# EAGLE design MainBRD (EAGLE 6.1)

## Sheet 1 of 2
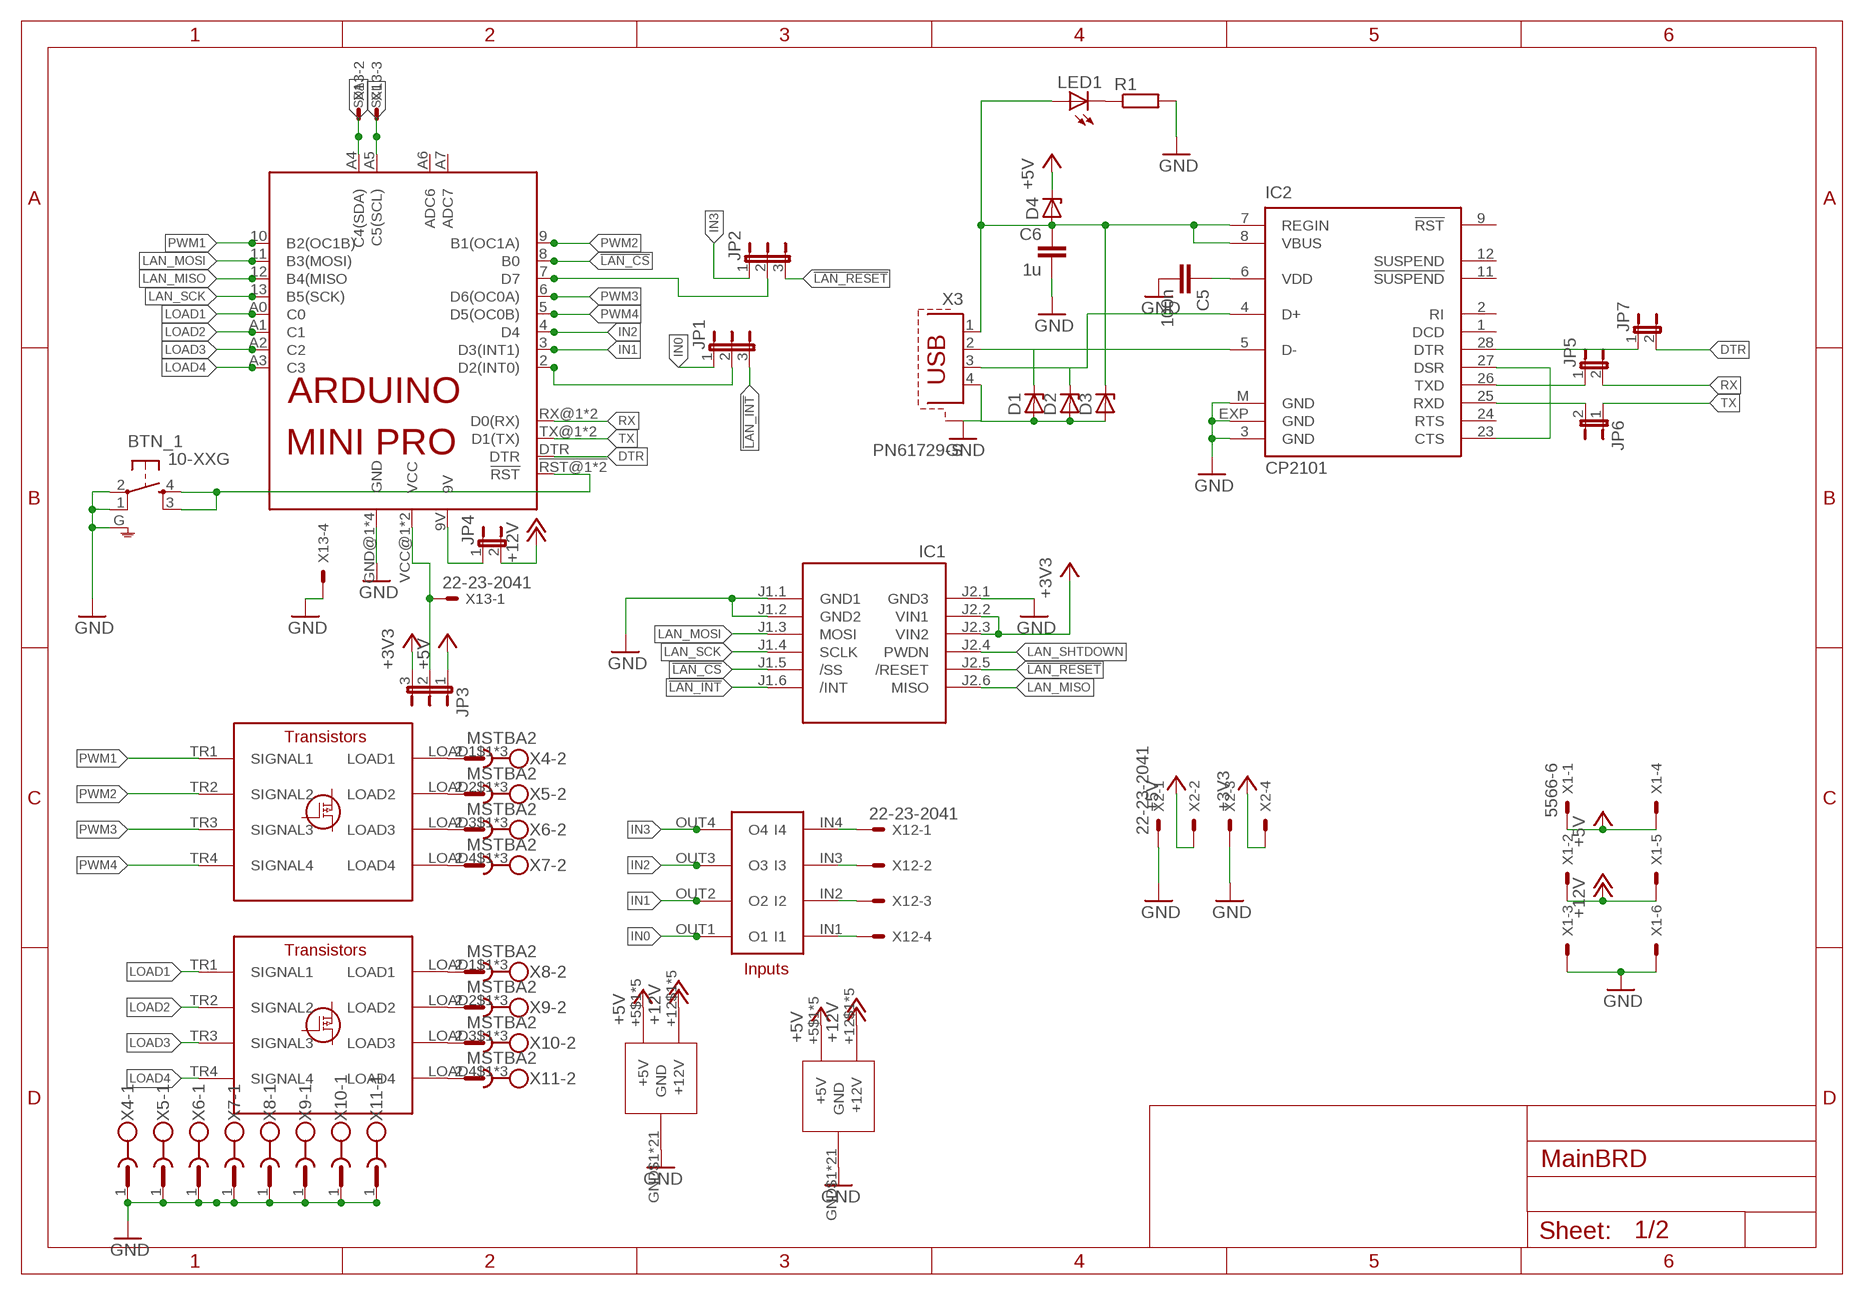
[diagram p0: schematic, sheet 1]

### Parts
BTN_1  10-XXG  [B3F-10XXG]
C5  100n  C-EUC0805  [C0805]
C6  1u  C-EUC1206  [C1206]
D1  ZENER-DIODESOD80C  [SOD80C]
D2  ZENER-DIODESOD80C  [SOD80C]
D3  ZENER-DIODESOD80C  [SOD80C]
D4  ZENER-DIODESOD80C  [SOD80C]
IC1  WIZ820IO_DEVICE'DUAL-IN-LINE'  [WIZ820IO]
IC2  CP2101  [MLP28]
JP1  JP2E  [JP2]
JP2  JP2E  [JP2]
JP3  JP2E  [JP2]
JP4  JP1E  [JP1]
JP5  JP1E  [JP1]
JP6  JP1E  [JP1]
JP7  JP1E  [JP1]
LED1  LEDCHIPLED_1206  [CHIPLED_1206]
R1  R-EU_M0805  [M0805]
U$1  ARDUINO_MINI_PRO  [ARDUINO_MINI_PRO]
U$2  KBLES_TRANSISTOR  [KBLES_TRANSISTOR]
U$3  KBLES_TRANSISTOR  [KBLES_TRANSISTOR]
X1  5566-6  [5566-6]
X2  22-23-2041  [22-23-2041]
X3  PN61729-S  [PN61729-S]
X4  MSTBA2  [MSTBA2]
X5  MSTBA2  [MSTBA2]
X6  MSTBA2  [MSTBA2]
X7  MSTBA2  [MSTBA2]
X8  MSTBA2  [MSTBA2]
X9  MSTBA2  [MSTBA2]
X10  MSTBA2  [MSTBA2]
X11  MSTBA2  [MSTBA2]
X12  22-23-2041  [22-23-2041]
X13  22-23-2041  [22-23-2041]

### Nets
!LAN_CS: IC1.J1.5(/SS) U$1.8(B0)
!LAN_INT: IC1.J1.6(/INT) JP1.3
!LAN_RESET: IC1.J2.5(/RESET) JP2.3
+3V3: IC1.J2.2(VIN1) IC1.J2.3(VIN2) JP3.3 X2.4
+5V: D4.C JP3.1 U$2.+5$1(+5V) U$2.+5$2(+5V) U$2.+5$3(+5V) U$2.+5$4(+5V) U$2.+5$5(+5V) U$3.+5$1(+5V) U$3.+5$2(+5V) U$3.+5$3(+5V) U$3.+5$4(+5V) U$3.+5$5(+5V) X1.1 X1.4 X2.2
+12V: JP4.2 U$2.+12$1(+12V) U$2.+12$2(+12V) U$2.+12$3(+12V) U$2.+12$4(+12V) U$2.+12$5(+12V) U$3.+12$1(+12V) U$3.+12$2(+12V) U$3.+12$3(+12V) U$3.+12$4(+12V) U$3.+12$5(+12V) X1.2 X1.5
DSR/CTS: IC2.23(CTS) IC2.27(DSR)
DTR: JP7.2 U$1.DTR
GND: BTN_1.1 BTN_1.2(P) BTN_1.G(GND) C5.2 C6.2 D1.A D2.A D3.A IC1.J1.1(GND1) IC1.J1.2(GND2) IC1.J2.1(GND3) IC2.3(GND) IC2.EXP(GND) IC2.M(GND) R1.2 U$1.GND@1(GND) U$1.GND@2(GND) U$1.GND@3(GND) U$1.GND@4(GND) U$2.GND$1(GND) U$2.GND$2(GND) U$2.GND$3(GND) U$2.GND$4(GND) U$2.GND$5(GND) U$2.GND$6(GND) U$2.GND$7(GND) U$2.GND$8(GND) U$2.GND$9(GND) U$2.GND$10(GND) U$2.GND$11(GND) U$2.GND$12(GND) U$2.GND$13(GND) U$2.GND$14(GND) U$2.GND$15(GND) U$2.GND$16(GND) U$2.GND$17(GND) U$2.GND$18(GND) U$2.GND$19(GND) U$2.GND$20(GND) U$2.GND$21(GND) U$3.GND$1(GND) U$3.GND$2(GND) U$3.GND$3(GND) U$3.GND$4(GND) U$3.GND$5(GND) U$3.GND$6(GND) U$3.GND$7(GND) U$3.GND$8(GND) U$3.GND$9(GND) U$3.GND$10(GND) U$3.GND$11(GND) U$3.GND$12(GND) U$3.GND$13(GND) U$3.GND$14(GND) U$3.GND$15(GND) U$3.GND$16(GND) U$3.GND$17(GND) U$3.GND$18(GND) U$3.GND$19(GND) U$3.GND$20(GND) U$3.GND$21(GND) X1.3 X1.6 X2.1 X2.3 X3.4 X3.SHLD@1(S1) X3.SHLD@2(S1) X4.1 X5.1 X6.1 X7.1 X8.1 X9.1 X10.1 X11.1 X13.4
IN0: JP1.1 U$2.OUT1(O1)
IN1: U$1.3(D3(INT1)) U$2.OUT2(O2)
IN2: U$1.4(D4) U$2.OUT3(O3)
IN3: JP2.1 U$2.OUT4(O4)
LAN_MISO: IC1.J2.6(MISO) U$1.12(B4(MISO)
LAN_MOSI: IC1.J1.3(MOSI) U$1.11(B3(MOSI))
LAN_SCK: IC1.J1.4(SCLK) U$1.13(B5(SCK))
LAN_SHTDOWN: IC1.J2.4(PWDN)
LOAD1: U$1.A0(C0) U$3.TR1(SIGNAL1)
LOAD2: U$1.A1(C1) U$3.TR2(SIGNAL2)
LOAD3: U$1.A2(C2) U$3.TR3(SIGNAL3)
LOAD4: U$1.A3(C3) U$3.TR4(SIGNAL4)
N$1: JP1.2 U$1.2(D2(INT0))
N$2: JP4.1 U$1.9V
N$3: JP3.2 U$1.VCC@1(VCC) U$1.VCC@2(VCC) X13.1
N$4: C6.1 D3.C D4.A IC2.7(REGIN) IC2.8(VBUS) LED1.A X3.1
N$5: JP2.2 U$1.7(D7)
N$6: IC2.25(RXD) JP6.2
N$7: D2.C IC2.4(D+) X3.3
N$8: IC2.26(TXD) JP5.1
N$9: D1.C IC2.5(D-) X3.2
N$10: IC2.28(DTR) JP7.1
N$11: U$2.LOAD1$1(LOAD1) U$2.LOAD1$2(LOAD1) U$2.LOAD1$3(LOAD1) X4.2
N$12: C5.1 IC2.6(VDD)
N$13: U$2.LOAD2$1(LOAD2) U$2.LOAD2$2.(LOAD2) U$2.LOAD2$3(LOAD2) X5.2
N$14: U$2.LOAD3$1(LOAD3) U$2.LOAD3$2(LOAD3) U$2.LOAD3$3(LOAD3) X6.2
N$15: U$2.LOAD4$1(LOAD4) U$2.LOAD4$2(LOAD4) U$2.LOAD4$3(LOAD4) X7.2
N$16: LED1.C R1.1
N$17: U$3.LOAD1$1(LOAD1) U$3.LOAD1$2(LOAD1) U$3.LOAD1$3(LOAD1) X8.2
N$18: U$3.LOAD2$1(LOAD2) U$3.LOAD2$2.(LOAD2) U$3.LOAD2$3(LOAD2) X9.2
N$19: U$3.LOAD3$1(LOAD3) U$3.LOAD3$2(LOAD3) U$3.LOAD3$3(LOAD3) X10.2
N$20: U$3.LOAD4$1(LOAD4) U$3.LOAD4$2(LOAD4) U$3.LOAD4$3(LOAD4) X11.2
N$21: U$2.IN4(I4) X12.1
N$22: U$2.IN3(I3) X12.2
N$23: U$2.IN2(I2) X12.3
N$24: U$2.IN1(I1) X12.4
N$51: BTN_1.3(S1) BTN_1.4(S) U$1.!RST@1(!RST) U$1.!RST@2(!RST)
PWM1: U$1.10(B2(OC1B)) U$2.TR1(SIGNAL1)
PWM2: U$1.9(B1(OC1A)) U$2.TR2(SIGNAL2)
PWM3: U$1.6(D6(OC0A)) U$2.TR3(SIGNAL3)
PWM4: U$1.5(D5(OC0B)) U$2.TR4(SIGNAL4)
RX: JP5.2 U$1.RX@1(D0(RX)) U$1.RX@2(D0(RX))
SCL: U$1.A5(C5(SCL)) X13.3
SDA: U$1.A4(C4(SDA)) X13.2
TX: JP6.1 U$1.TX@1(D1(TX)) U$1.TX@2(D1(TX))
Unconnected: IC2.1(DCD) IC2.2(RI) IC2.9(!RST) IC2.11(!SUSPEND) IC2.12(SUSPEND) IC2.24(RTS) U$1.A6(ADC6) U$1.A7(ADC7) U$3.IN1(I1) U$3.IN2(I2) U$3.IN3(I3) U$3.IN4(I4) U$3.OUT1(O1) U$3.OUT2(O2) U$3.OUT3(O3) U$3.OUT4(O4)

## Sheet 2 of 2

## Library data of the parts
BTN_1 = switch-omron:10-XXG
C5 C6 = resistor:C-EU: CAPACITOR, European symbol
D1-D4 = diode:ZENER-DIODE: Z-Diode
IC1 = Wiz820io:WIZ820IO_DEVICE: WIZnet, WIZ820io plug in module incl. W5200 chip and MagJack
IC2 = silabs:CP210*: Single-Chip USB to UART Bridge Source: www.silabs.com .. CP2101.pdf / cp2102.pdf; MF: FARNELL; MPN: CP2102-GM; OC_FARNELL: 9282130; OC_NEWARK: 30K5635
JP1-JP3 = jumper:JP2E: JUMPER
JP4-JP7 = jumper:JP1E: JUMPER
LED1 = led:LED: LED OSRAM: - CHIPLED LG R971, LG N971, LY N971, LG Q971, LY Q971, LO R971, LY R971 LH N974, LH R974 LS Q976, LO Q976, LY Q976 LO Q996 - Hyper CHIPLED LW Q18S LB Q993, LB Q99A, LB R99A - SideLED LS A670, LO A670, LY A670, LG A670, LP A670 LB A673, LV A673, LT A673, LW A673 LH A674 LY A675 LS A676, LA A676, LO A676, LY A676, LW A676 LS A679, LY A679, LG A679 - Hyper Micro SIDELED® LS Y876, LA Y876, LO Y876, LY Y876 LT Y87S - SmartLED LW L88C, LW L88S LB L89C, LB L89S, LG L890 LS L89K, LO L89K, LY L89K LS L896, LA L896, LO L896, LY L896 - TOPLED LS T670, LO T670, LY T670, LG T670, LP T670 LSG T670, LSP T670, LSY T670, LOP T670, LYG T670 LG T671, LOG T671, LSG T671 LB T673, LV T673, LT T673, LW T673 LH T674 LS T676, LA T676, LO T676, LY T676, LB T676, LH T676, LSB T676, LW T676 LB T67C, LV T67C, LT T67C, LS T67K, LO T67K, LY T67K, LW E67C LS E67B, LA E67B, LO E67B, LY E67B, LB E67C, LV E67C, LT E67C LW T67C LS T679, LY T679, LG T679 LS T770, LO T770, LY T770, LG T770, LP T770 LB T773, LV T773, LT T773, LW T773 LH T774 LS E675, LA E675, LY E675, LS T675 LS T776, LA T776, LO T776, LY T776, LB T776 LHGB T686 LT T68C, LB T68C - Hyper Mini TOPLED® LB M676 - Mini TOPLED Santana® LG M470 LS M47K, LO M47K, LY M47K Source: http://www.osram.convergy.de LUXEON: - LUMILED® LXK2-PW12-R00, LXK2-PW12-S00, LXK2-PW14-U00, LXK2-PW14-V00 LXK2-PM12-R00, LXK2-PM12-S00, LXK2-PM14-U00 LXK2-PE12-Q00, LXK2-PE12-R00, LXK2-PE12-S00, LXK2-PE14-T00, LXK2-PE14-U00 LXK2-PB12-K00, LXK2-PB12-L00, LXK2-PB12-M00, LXK2-PB14-N00, LXK2-PB14-P00, LXK2-PB14-Q00 LXK2-PR12-L00, LXK2-PR12-M00, LXK2-PR14-Q00, LXK2-PR14-R00 LXK2-PD12-Q00, LXK2-PD12-R00, LXK2-PD12-S00 LXK2-PH12-R00, LXK2-PH12-S00 LXK2-PL12-P00, LXK2-PL12-Q00, LXK2-PL12-R00 Source: www.luxeon.com KINGBRIGHT: KA-3528ASYC Source: www.kingbright.com
R1 = resistor:R-EU_: RESISTOR, European symbol
U$1 = E14_Arduino_published:ARDUINO_MINI_PRO
U$2 U$3 = Transistor_module:KBLES_TRANSISTOR
X1 = con-molex:5566-6: Mini FIT connector 6 pol Source: http://www.molex.com; MPN: 95566-61002; OC_FARNELL: unknown; OC_NEWARK: 22K8620
X2 X12 X13 = con-molex:22-23-2041: .100" (2.54mm) Center Header - 4 Pin; MF: MOLEX; MPN: 22-23-2041; OC_FARNELL: 1462920; OC_NEWARK: 38C0355
X3 = con-berg:PN61729-S: BERG USB connector; OC_FARNELL: unknown; OC_NEWARK: unknown
X4-X11 = con-phoenix-508:MSTBA2: PHOENIX; MF: FARNELL; MPN: 1757242; OC_FARNELL: 3705171; OC_NEWARK: 71C4161

## Board
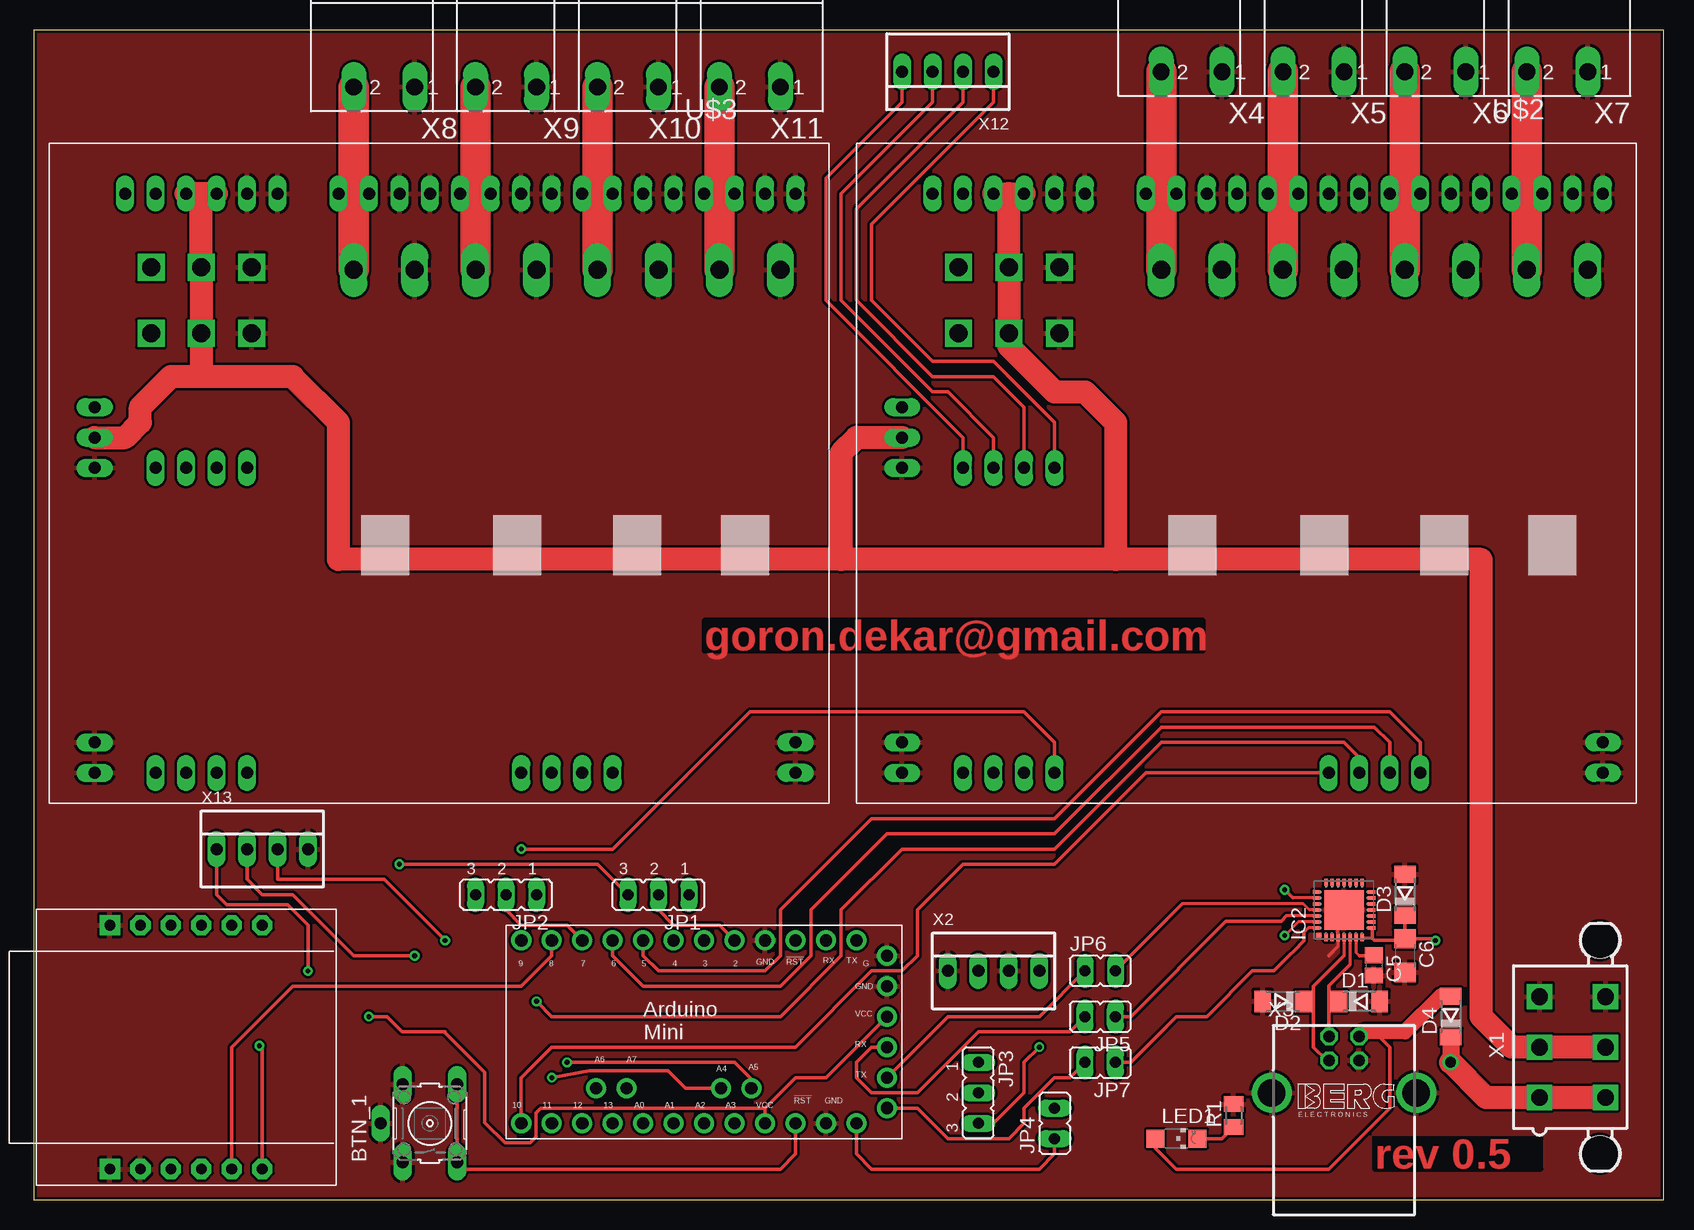
[diagram p1: board, top side]
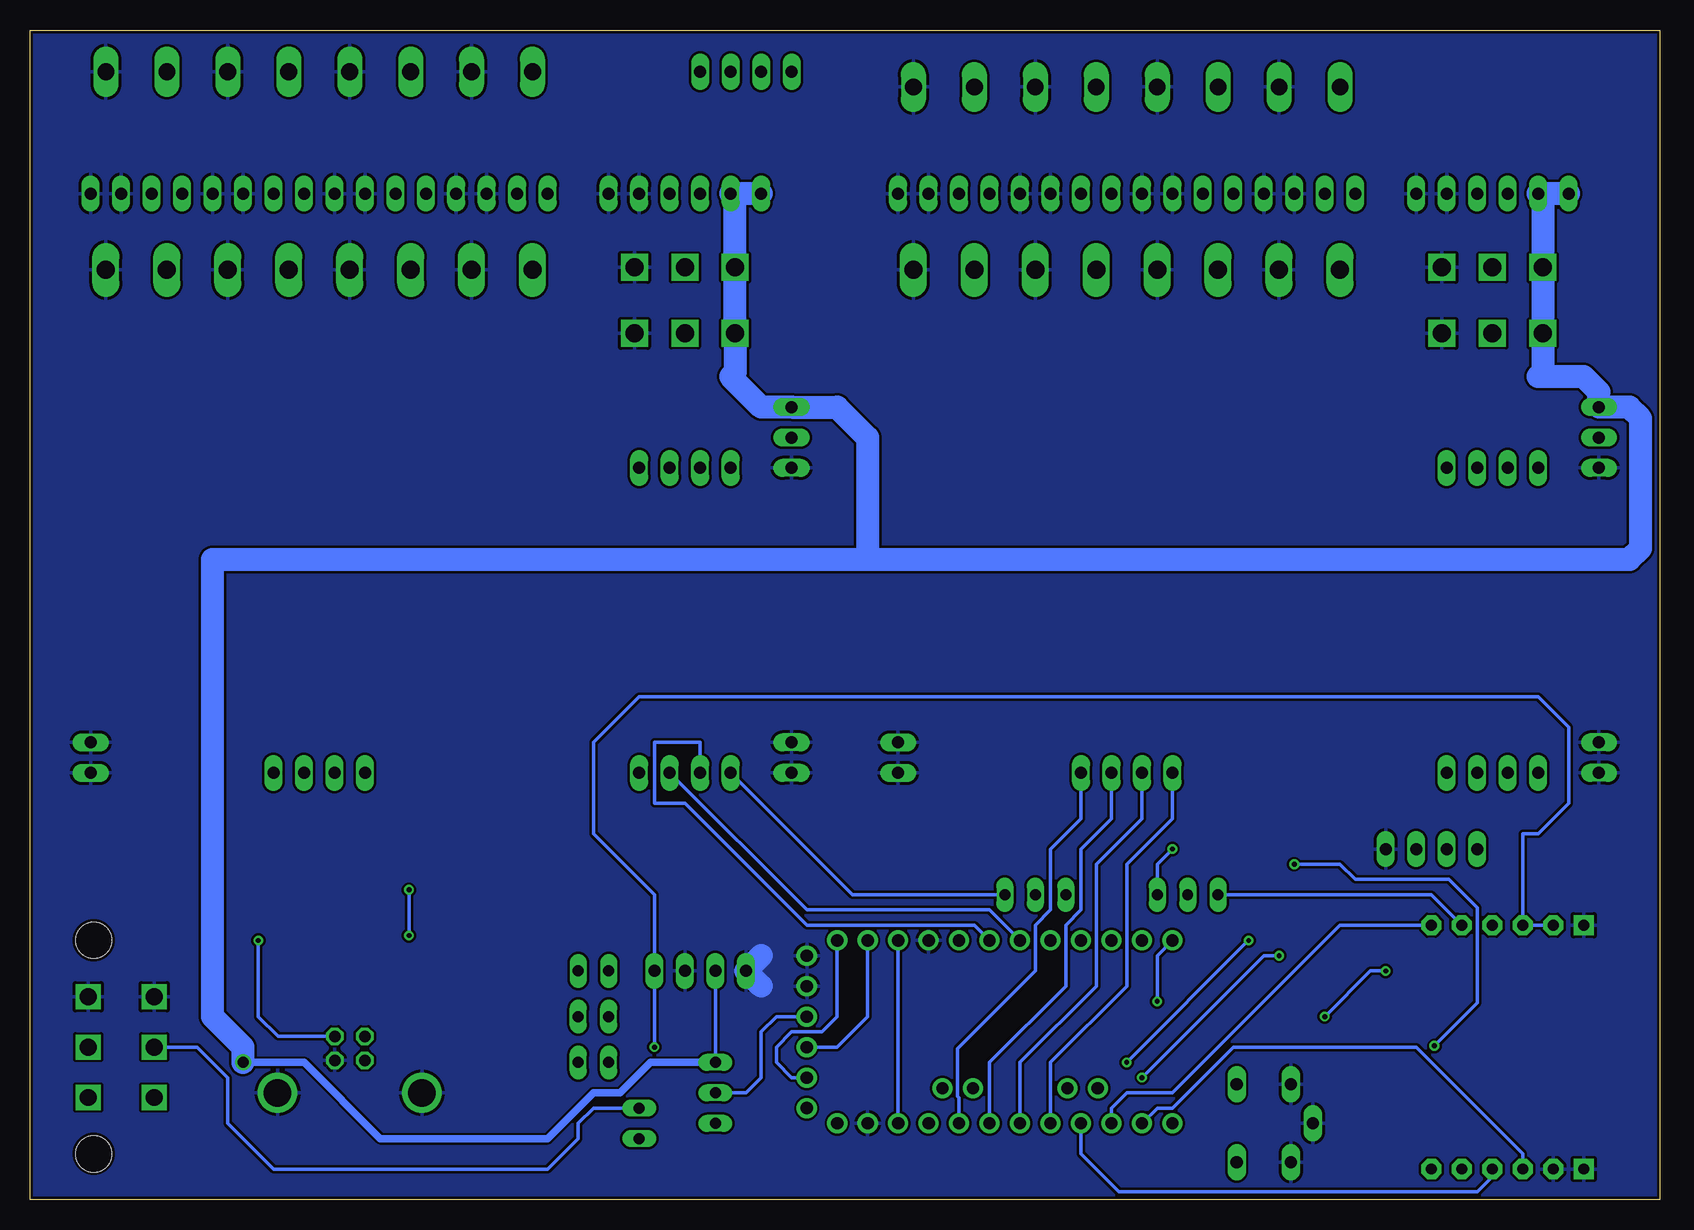
[diagram p2: board, bottom side, seen from below]

Size 135.87 x 97.46 mm. Coordinates in mm from the lower left corner, seen from the top.
Outline: 0,0 135.87,0 135.87,97.46 0,97.46 0,0
Copper layers (1+16): Top 0.0178mm / dielectric 1.5011mm / Bottom 0.0178mm
Design rules: minimum track width 0.2mm, minimum drill 0.4mm, track to track 0.2mm, track to pad 0.2mm, pad to pad 0.2mm, via to via 0.2mm, smd to smd 0mil, copper to edge 0.25mm, drill to drill 0.2mm, minimum pad ring 10mil, minimum via ring 8mil, stop-mask expansion 4mil, vias tented up to drill 0.5mm, thermal gap 10mil

### Footprints (pad centres in the part's own frame; a part is rotated, then mirrored left to right if it is on the bottom)
B3F-10XXG = drill 1.016 long: 1 -3.251,2.261; 2 3.251,2.261; 3 -3.251,-2.261; 4 3.251,-2.261; G 0,4.1
C0805 = smd 1.3 x 1.5: 1 -0.85,0; 2 0.85,0
C1206 = smd 1.6 x 1.8: 1 -1.4,0; 2 1.4,0
SOD80C = smd 1.4 x 1.8: A 1.7,0; C -1.7,0
WIZ820IO = drill 0.9 pad 1.676 square: J1.1 -10.16,6.35; J2.1 10.16,6.35 | drill 0.9 pad 1.676 octagon: J1.2 -10.16,3.81; J1.3 -10.16,1.27; J1.4 -10.16,-1.27; J1.5 -10.16,-3.81; J1.6 -10.16,-6.35; J2.2 10.16,3.81; J2.3 10.16,1.27; J2.4 10.16,-1.27; J2.5 10.16,-3.81; J2.6 10.16,-6.35
MLP28 = smd 0.6 x 0.3: 1 -2.3,1.5; 2 -2.3,1; 3 -2.3,0.5; 4 -2.3,0; 5 -2.3,-0.5; 6 -2.3,-1; 7 -2.3,-1.5; 15 2.3,-1.5; 16 2.3,-1; 17 2.3,-0.5; 18 2.3,0; 19 2.3,0.5; 20 2.3,1; 21 2.3,1.5 | smd 0.3 x 0.6: 8 -1.5,-2.3; 9 -1,-2.3; 10 -0.5,-2.3; 11 0,-2.3; 12 0.5,-2.3; 13 1,-2.3; 14 1.5,-2.3; 22 1.5,2.3; 23 1,2.3; 24 0.5,2.3; 25 0,2.3; 26 -0.5,2.3; 27 -1,2.3; 28 -1.5,2.3 | smd 3.3 x 3.3: EXP 0,0 | smd 0.435 x 0.435: M -2.103,2.103
JP2 = drill 0.914 long: 1 -2.54,0; 2 0,0; 3 2.54,0
JP1 = drill 0.914 long: 1 0,-1.27; 2 0,1.27
CHIPLED_1206 = smd 1.5 x 1.5: A 0,-1.75; C 0,1.75
M0805 = smd 1.3 x 1.6: 1 -0.95,0; 2 0.95,0
ARDUINO_MINI_PRO = drill 1.016 pad 1.676: 2 19.05,16.51; 3 16.51,16.51; 4 13.97,16.51; 5 11.43,16.51; 6 8.89,16.51; 7 6.35,16.51; 8 3.81,16.51; 9 1.27,16.51; 9V 29.21,1.27; 10 1.27,1.27; 11 3.81,1.27; 12 6.35,1.27; 13 8.89,1.27; !RST@1 24.13,1.27; !RST@2 24.13,16.51; A0 11.43,1.27; A1 13.97,1.27; A2 16.51,1.27; A3 19.05,1.27; A4 17.907,4.191; A5 20.447,4.191; A6 7.493,4.191; A7 10.033,4.191; DTR 31.75,2.54; GND@1 21.59,16.51; GND@2 31.75,15.24; GND@3 31.75,12.7; GND@4 26.67,1.27; RX@1 26.67,16.51; RX@2 31.75,7.62; TX@1 29.21,16.51; TX@2 31.75,5.08; VCC@1 31.75,10.16; VCC@2 21.59,1.27
KBLES_TRANSISTOR = drill 1 long: +5$1 6.35,50.8; +5$2 8.89,50.8; +5$5 3.81,33.02; +12$1 11.43,50.8; +12$2 13.97,50.8; +12$5 3.81,30.48; GND$1 16.51,50.8; GND$2 19.05,50.8; GND$5 3.81,27.94; GND$6 3.81,5.08; GND$7 3.81,2.54; GND$8 62.23,5.08; GND$9 62.23,2.54; GND$14 29.21,50.8; GND$15 31.75,50.8; GND$16 39.37,50.8; GND$17 41.91,50.8; GND$18 49.53,50.8; GND$19 52.07,50.8; GND$20 59.69,50.8; GND$21 62.23,50.8; IN1 8.89,27.94; IN2 11.43,27.94; IN3 13.97,27.94; IN4 16.51,27.94; LOAD1$2 24.13,50.8; LOAD1$3 26.67,50.8; LOAD2$2. 34.29,50.8; LOAD2$3 36.83,50.8; LOAD3$2 44.45,50.8; LOAD3$3 46.99,50.8; LOAD4$2 54.61,50.8; LOAD4$3 57.15,50.8; OUT1 8.89,2.54; OUT2 11.43,2.54; OUT3 13.97,2.54; OUT4 16.51,2.54; TR1 39.37,2.54; TR2 41.91,2.54; TR3 44.45,2.54; TR4 46.99,2.54 | drill 1.5 square: +5$3 8.5,44.66; +5$4 8.5,39.16; +12$3 12.7,44.66; +12$4 12.7,39.16; GND$3 16.9,44.66; GND$4 16.9,39.16 | drill 1.5 long: GND$10 30.48,44.45; GND$11 40.64,44.45; GND$12 50.8,44.45; GND$13 60.96,44.45; LOAD1$1 25.4,44.45; LOAD2$1 35.56,44.45; LOAD3$1 45.72,44.45; LOAD4$1 55.88,44.45
5566-6 = drill 1.4 square: 1 4.2,-2.75; 2 0,-2.75; 3 -4.2,-2.75; 4 4.2,2.75; 5 0,2.75; 6 -4.2,2.75 | hole 3: 8.9,2.29; -8.9,2.29
22-23-2041 = drill 1 long: 1 -3.81,0; 2 -1.27,0; 3 1.27,0; 4 3.81,0
PN61729-S = drill 0.95 octagon: 1 1.25,4.71; 2 -1.25,4.71; 3 -1.25,2.71; 4 1.25,2.71 | drill 2.3 pad 2.9: SHLD@1 -6.02,0; SHLD@2 6.02,0
MSTBA2 = drill 1.397 long: 1 -2.54,5.08; 2 2.54,5.08

### Placement (x,y rotation side)
BTN_1  33.02,6.35 90 top
C5  111.7,19.51 270 top
C6  114.3,20.32 270 top
D1  110.49,16.51 0 top
D2  104.14,16.51 180 top
D3  114.3,25.4 90 top
D4  118.11,15.24 90 top
IC1  12.7,12.7 90 top
IC2  109.22,24.13 90 top
JP1  52.07,25.4 180 top
JP2  39.37,25.4 180 top
JP3  78.74,8.89 270 top
JP4  85.09,6.35 0 top
JP5  88.9,15.24 90 top
JP6  88.9,19.05 270 top
JP7  88.9,11.43 90 top
LED1  95.25,5.08 270 top
R1  100.02,7 90 top
U$1  39.37,5.08 0 top
U$2  68.58,33.02 0 top
U$3  1.27,33.02 0 top
X1  128.27,12.7 270 top
X2  80.01,19.05 0 top
X3  109.22,8.89 0 top
X4  96.52,99.06 180 top
X5  106.68,99.06 180 top
X6  116.84,99.06 180 top
X7  127,99.06 180 top
X8  29.21,97.79 180 top
X9  39.37,97.79 180 top
X10  49.53,97.79 180 top
X11  59.69,97.79 180 top
X12  76.2,93.98 180 top
X13  19.05,29.21 0 top

### Tracks (layer width: path | path; a pad name or v marks a point on that pad's centre or on a via)
!LAN_CS
  Top 0.305: IC1.J1.5 16.51,12.7 21.59,17.78 40.64,17.78 43.18,20.32 U$1.8
!LAN_INT  (via drill 0.4)
  Top 0.305: IC1.J1.6 19.05,12.56 v18.8,12.81 | v30.48,27.94 46.99,27.94 JP1.3
  Bottom 0.305: v30.48,27.94 26.67,27.94 25.4,26.67 17.58,26.67 15.23,24.32 15.23,16.38 v18.8,12.81
!LAN_RESET
  Bottom 0.305: JP2.3 19.05,25.4 IC1.J2.5
+3V3  (via drill 0.4)
  Top 0.305: JP3.3 80.01,6.35 82.55,8.89 82.55,11.43 v83.82,12.7
  Bottom 0.305: IC1.J2.2 IC1.J2.3 11.43,30.48 10.16,30.48 7.62,33.02 7.62,39.37 10.16,41.91 85.09,41.91 88.9,38.1 88.9,30.48 83.82,25.4 X2.4 v83.82,12.7
+5V  (via drill 0.9)
  Top 1.422: D4.C v118.11,11.43
  Top 1.93: X1.4 X1.1 121.04,8.5 v118.11,11.43
  Bottom 0.305: JP3.1 X2.2
  Bottom 0.61: v118.11,11.43 113.03,11.43 106.68,5.08 92.71,5.08 88.9,8.89 86.67,8.89 84.13,11.43 JP3.1
  Bottom 1.93: v118.11,11.43 118.11,12.7 120.65,15.24 120.65,53.34 66.04,53.34 | U$3.+5$1 U$3.+5$2 9.77,83.43 U$3.+5$3 U$3.+5$4 9.77,68.97 10.16,68.58 6.35,68.58 5.08,67.31 U$3.+5$5 2.56,66.04 1.62,65.1 1.62,54.26 2.54,53.34 66.04,53.34 | U$2.+5$1 U$2.+5$2 77.08,83.43 U$2.+5$3 U$2.+5$4 77.08,68.97 77.47,68.58 74.93,66.04 U$2.+5$5 68.58,66.04 66.04,63.5 66.04,53.34
+12V
  Top 0.305: 123.19,12.7 X1.2
  Top 1.93: 13.97,68.58 11.43,68.58 8.89,66.04 8.89,64.77 7.62,63.5 U$3.+12$5 | X1.5 123.19,12.7 120.65,15.24 120.65,53.34 90.17,53.34 | U$3.+12$2 13.97,83.82 | 13.97,83.82 U$3.+12$1 | 13.97,83.82 U$3.+12$3 U$3.+12$4 13.97,68.58 | U$2.+12$1 81.28,83.82 | 81.28,83.82 U$2.+12$2 | 81.28,83.82 U$2.+12$3 U$2.+12$4 81.28,71.12 85.09,67.31 87.63,67.31 90.17,64.77 90.17,53.34 | 90.17,53.34 67.31,53.34 | 67.31,53.34 25.4,53.34 25.4,64.77 21.59,68.58 13.97,68.58 | U$2.+12$5 68.58,63.5 67.31,62.23 67.31,53.34
  Bottom 0.305: JP4.2 88.9,7.62 90.17,6.35 90.17,5.08 92.71,2.54 115.57,2.54 119.38,6.35 119.38,10.16 121.92,12.7 X1.2
DSR/CTS  (via drill 0.4)
  Top 0.254: IC2.27 105.41,23.13 v104.28,22 | IC2.23 104.95,25.13
  Top 0.305: 104.95,25.13 v104.28,25.81
  Bottom 0.305: v104.28,25.81 v104.28,22
DTR
  Top 0.305: JP7.2 86.36,10.16 85.09,10.16 82.55,7.62 82.55,6.35 81.28,5.08 76.2,5.08 73.66,7.62 U$1.DTR
GND
  Top 0.254: 108.72,23.63 IC2.3 108.72,21.09
  Top 0.305: 108.72,23.63 IC2.EXP | 108.72,21.09 107.95,20.32
  Bottom 1.93: 74.93,17.78 X2.1 74.93,20.32
  pour Top: 0,97.46 135.87,97.46 135.87,0 0,0
  pour Bottom: 0,0 135.87,0 135.87,97.46 0,97.46
IN0
  Bottom 0.305: U$2.OUT1 67.31,25.4 JP1.1
IN1
  Bottom 0.305: U$1.3 57.15,22.86 71.12,22.86 81.28,33.02 83.82,33.02 83.82,38.1 80.01,38.1 U$2.OUT2
IN2
  Bottom 0.305: U$2.OUT3 71.12,24.13 55.88,24.13 U$1.4
IN3  (via drill 0.4)
  Top 0.305: U$2.OUT4 85.09,38.1 82.55,40.64 59.69,40.64 48.26,29.21 v40.64,29.21
  Bottom 0.305: v40.64,29.21 41.91,27.94 JP2.1
LAN_MISO
  Bottom 0.305: U$1.12 45.72,7.62 44.45,8.89 40.64,8.89 26.67,22.86 IC1.J2.6
LAN_MOSI
  Bottom 0.305: U$1.11 41.91,7.62 40.64,7.62 35.56,12.7 20.32,12.7 11.43,3.81 IC1.J1.3
LAN_SCK
  Bottom 0.305: IC1.J1.4 13.97,1.91 15.24,0.64 45.09,0.64 48.26,3.81 U$1.13
LOAD1
  Bottom 0.305: U$3.TR1 40.64,31.75 44.45,27.94 44.45,17.78 50.8,11.43 U$1.A0
LOAD2
  Bottom 0.305: U$3.TR2 43.18,31.75 46.99,27.94 46.99,17.78 53.34,11.43 U$1.A1
LOAD3
  Bottom 0.305: U$3.TR3 45.72,31.75 48.26,29.21 48.26,24.13 49.53,22.86 49.53,17.78 55.88,11.43 U$1.A2
LOAD4
  Bottom 0.305: U$3.TR4 48.26,31.75 50.8,29.21 50.8,24.13 52.07,22.86 52.07,19.05 58.55,12.57 58.55,8.6 58.42,8.47 U$1.A3
N$1
  Top 0.305: U$1.2 57.15,22.86 53.34,22.86 52.07,24.13 JP1.2
N$2
  Top 0.305: JP4.1 85.09,3.81 83.82,2.54 69.85,2.54 68.58,3.81 U$1.9V
N$3  (via drill 0.4)
  Top 0.305: U$1.VCC@2 60.96,7.62 | 60.96,7.62 63.5,10.16 66.04,10.16 U$1.VCC@1 | 60.96,7.62 42.27,7.62 41.88,7.23 41.88,5.24 41.36,4.73 39.29,4.73 37.6,6.42 37.6,10.6 34.29,13.91 34.29,13.97 30.71,13.97 29.44,15.24 v27.94,15.24 | X13.1 15.24,25.4 16.09,24.55 21.17,24.55 22.86,22.86 v22.86,19.05
  Bottom 0.305: JP3.2 76.2,8.89 74.93,10.16 74.93,13.97 73.66,15.24 U$1.VCC@1 | v27.94,15.24 24.13,19.05 v22.86,19.05
N$4  (via drill 0.4)
  Top 0.254: IC2.7 111.52,21.83 IC2.8
  Top 0.305: 111.52,21.83 111.76,21.59 114.17,21.59 C6.1 | C6.1 116.71,21.72 v116.84,21.59 | C6.1 D3.C | X3.1 112.13,13.6 113.03,12.7 113.03,7.62 107.95,2.54 95.25,2.54 93.5,4.29 LED1.A
  Top 1.27: D4.A 117.27,16.94 114.3,13.97 110.84,13.97 X3.1
  Bottom 0.305: v116.84,21.59 116.84,15.24 115.2,13.6 X3.1
N$5
  Top 0.305: JP2.2 39.37,24.13 40.64,22.86 44.45,22.86 U$1.7
N$6
  Top 0.254: IC2.25 106.35,24.13 105.85,24.63 95.75,24.63
  Top 0.305: 95.75,24.63 JP6.2
N$7
  Top 0.254: IC2.4 109.22,20.32
  Top 0.305: X3.3 107.78,11.6 106.68,12.7 106.68,16.51 | 106.68,16.51 106.68,17.78 109.22,20.32 | D2.C 106.68,16.51
N$8
  Top 0.254: IC2.26 104.42,23.63
  Top 0.305: 104.42,23.63 103.99,23.19 99.39,23.19 91.44,15.24 JP5.1
N$9
  Top 0.254: IC2.5 109.72,19.55
  Top 0.305: X3.2 107.97,16.51 | 107.97,16.51 107.97,17.8 109.72,19.55 | D1.C 107.97,16.51
N$10
  Top 0.254: IC2.28 106.27,22.63 105.89,22.25
  Top 0.305: 105.89,22.25 105.89,21.55 105.03,20.7 104.72,20.38 103.39,19.05 101.6,19.05 97.79,15.24 95.25,15.24 91.44,11.43 JP7.1
N$11
  Top 1.27: U$2.LOAD1$2 93.98,83.82 U$2.LOAD1$3
  Top 2.54: U$2.LOAD1$1 93.98,83.82 X4.2
N$12
  Top 0.254: IC2.6 110.22,20.59 110.49,20.32
  Top 0.305: 110.49,20.32 111.66,20.32 C5.1
N$13
  Top 1.27: U$2.LOAD2$2. 104.14,83.82 U$2.LOAD2$3
  Top 2.54: U$2.LOAD2$1 104.14,83.82 X5.2
N$14
  Top 1.27: U$2.LOAD3$2 114.3,83.82 U$2.LOAD3$3
  Top 2.54: U$2.LOAD3$1 114.3,83.82 X6.2
N$15
  Top 1.27: U$2.LOAD4$2 124.46,83.82 U$2.LOAD4$3
  Top 2.54: U$2.LOAD4$1 124.46,83.82 X7.2
N$16
  Top 0.305: LED1.C 99.05,5.08 R1.1
N$17
  Top 1.27: U$3.LOAD1$2 26.67,83.82 U$3.LOAD1$3
  Top 2.54: U$3.LOAD1$1 26.67,83.82 X8.2
N$18
  Top 1.27: U$3.LOAD2$2. 36.83,83.82 U$3.LOAD2$3
  Top 2.54: U$3.LOAD2$1 36.83,83.82 X9.2
N$19
  Top 1.27: U$3.LOAD3$2 46.99,83.82 U$3.LOAD3$3
  Top 2.54: U$3.LOAD3$1 46.99,83.82 X10.2
N$20
  Top 1.27: U$3.LOAD4$2 57.15,83.82 U$3.LOAD4$3
  Top 2.54: U$3.LOAD4$1 57.15,83.82 X11.2
N$21
  Top 0.305: U$2.IN4 85.09,64.77 80.01,69.85 74.93,69.85 69.85,74.93 69.85,81.28 80.01,91.44 X12.1
N$22
  Top 0.305: U$2.IN3 82.55,66.04 80.01,68.58 74.93,68.58 68.58,74.93 68.58,82.55 77.47,91.44 X12.2
N$23
  Top 0.305: U$2.IN2 80.01,63.5 76.2,67.31 74.93,67.31 67.31,74.93 67.31,83.82 74.93,91.44 X12.3
N$24
  Top 0.305: U$2.IN1 77.47,63.5 66.04,74.93 66.04,85.09 72.39,91.44 X12.4
N$51
  Top 0.305: BTN_1.4 BTN_1.3 35.84,2.54 62.23,2.54 63.5,3.81 U$1.!RST@1
  Bottom 0.305: U$1.!RST@2 U$1.!RST@1
PWM1
  Top 0.305: U$1.10 40.64,10.16 43.18,12.7 63.5,12.7 69.85,19.05 72.39,19.05 73.66,20.32 73.66,24.13 77.47,27.94 85.09,27.94 92.71,35.56 U$2.TR1
PWM2  (via drill 0.4)
  Top 0.305: v41.91,16.51 43.18,15.24 62.23,15.24 67.31,20.32 67.31,24.13 72.39,29.21 85.09,29.21 93.98,38.1 109.22,38.1 110.49,36.83 U$2.TR2
  Bottom 0.305: U$1.9 41.91,20.32 v41.91,16.51
PWM3
  Top 0.305: U$1.6 48.26,20.32 50.8,17.78 62.23,17.78 64.77,20.32 64.77,24.13 71.12,30.48 85.09,30.48 93.98,39.37 111.76,39.37 113.03,38.1 U$2.TR3
PWM4
  Top 0.305: U$1.5 50.8,20.32 52.07,19.05 60.96,19.05 62.23,20.32 62.23,24.13 69.85,31.75 85.09,31.75 93.98,40.64 113.03,40.64 115.57,38.1 U$2.TR4
RX
  Top 0.305: JP5.2 86.36,13.97 78.74,13.97 73.66,8.89 69.85,8.89 68.58,10.16 68.58,11.43 69.85,12.7 U$1.RX@2
  Bottom 0.305: U$1.RX@1 66.04,15.24 68.58,12.7 U$1.RX@2
SCL  (via drill 0.4)
  Top 0.305: U$1.A5 59.82,10.03 58.42,11.43 v44.45,11.43 | X13.3 20.32,26.67 29.21,26.67 v34.29,21.59
  Bottom 0.305: v44.45,11.43 v34.29,21.59
SDA  (via drill 0.4)
  Top 0.305: U$1.A4 54.34,9.27 52.89,10.72 46.28,10.72 v43.18,10.16 | X13.2 17.78,26.67 19.05,25.4 21.59,25.4 26.67,20.32 v31.75,20.32
  Bottom 0.305: v43.18,10.16 33.02,20.32 v31.75,20.32
TX
  Top 0.305: JP6.1 83.82,15.24 76.2,15.24 U$1.TX@2
  Bottom 0.305: U$1.TX@1 68.58,15.24 69.85,13.97 72.39,13.97 73.66,12.7 73.66,11.43 72.39,10.16 U$1.TX@2

### Text on the board
Top: goron.dekar@gmail.com | rev 0.5